# Altium schematic sheet PRYECTO.SchDoc
size B
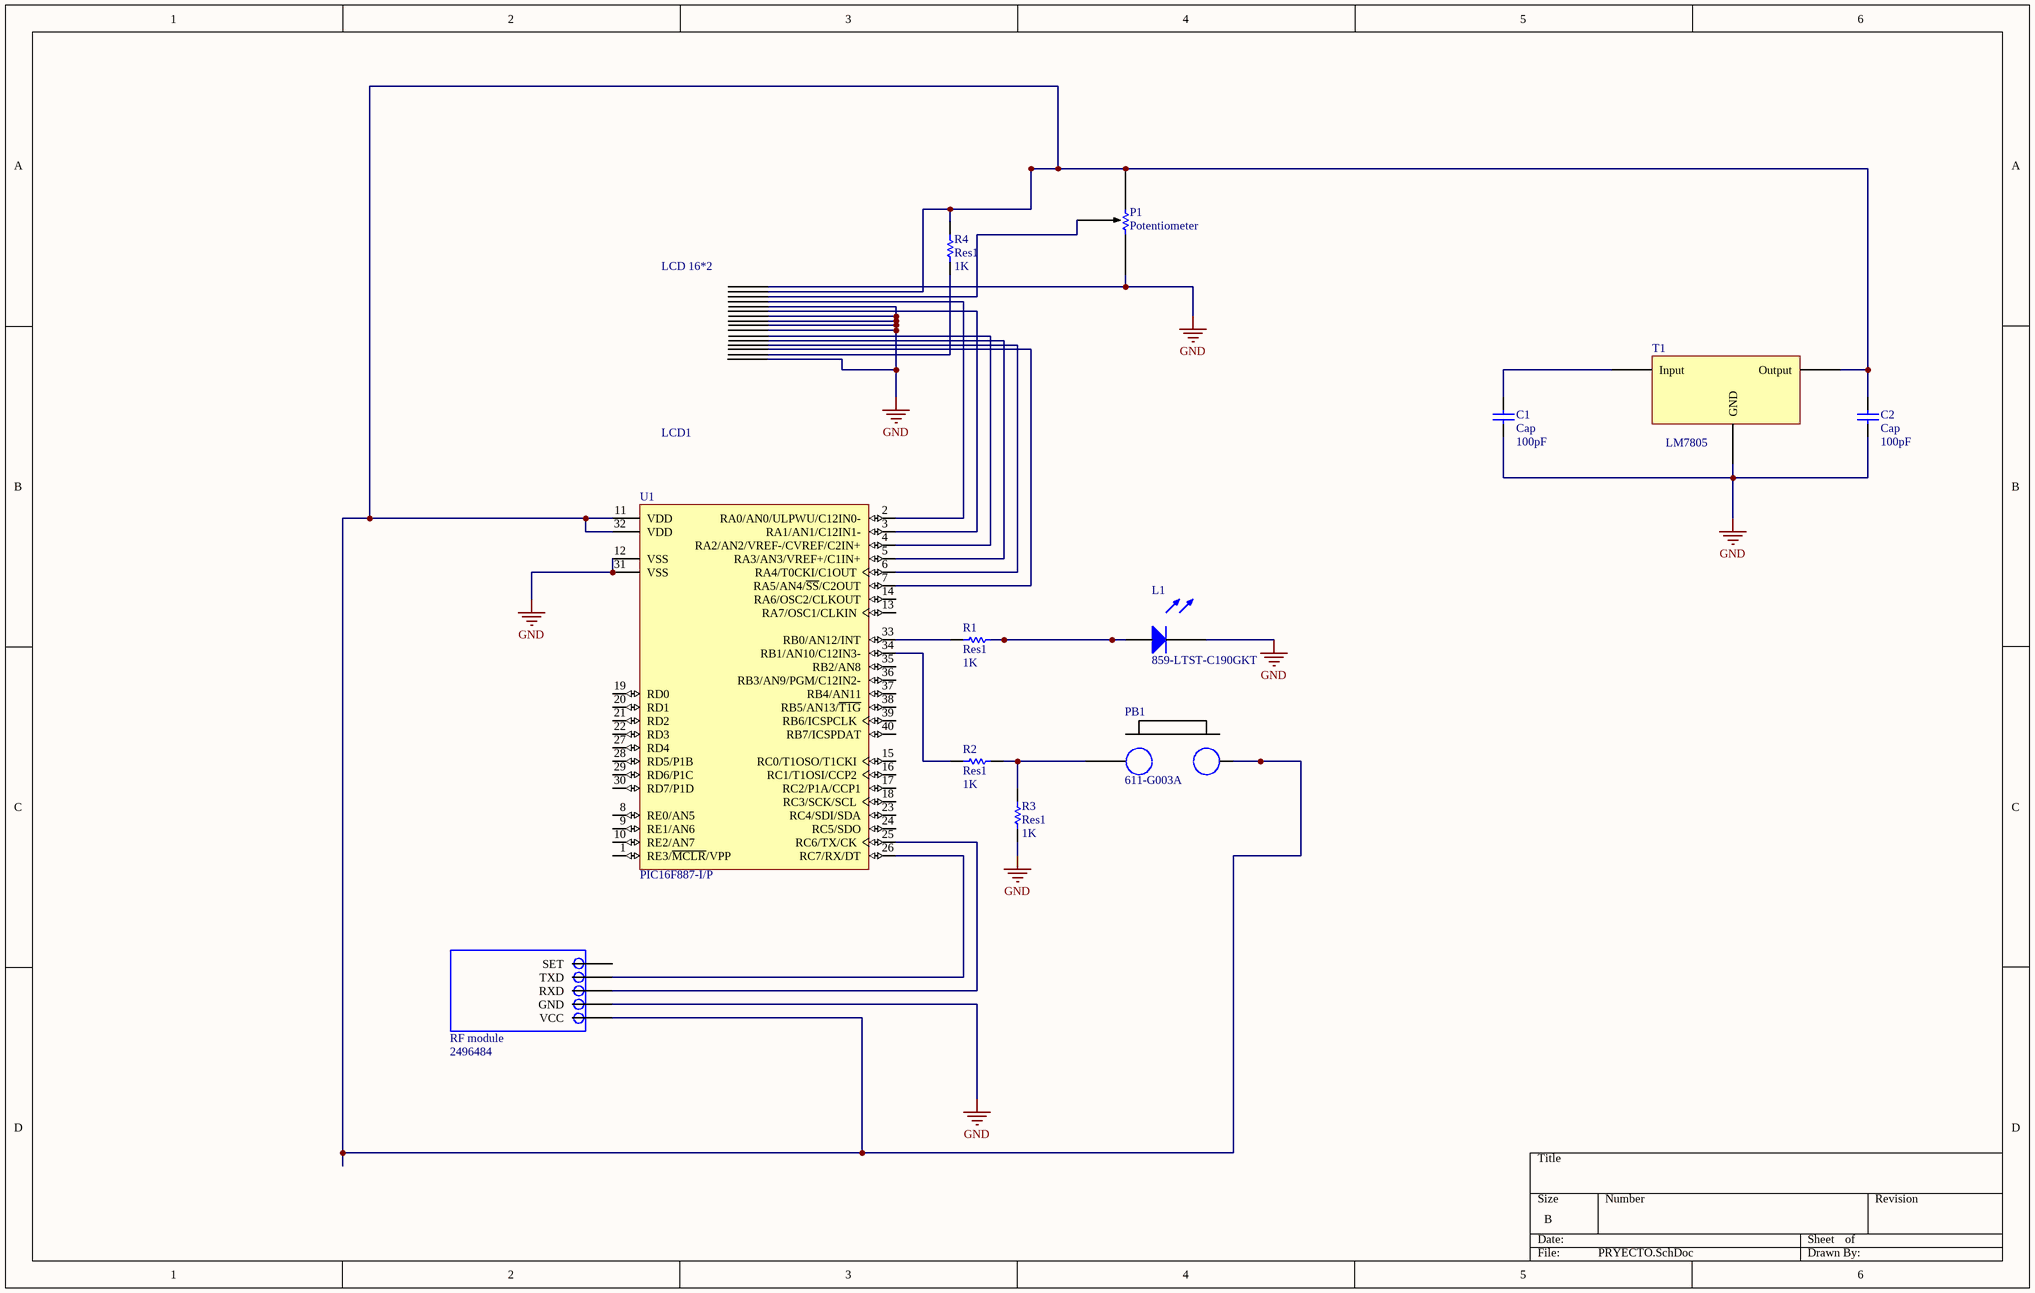
[diagram p0: PRYECTO.SchDoc]

## Parts
C1  Cap  value 100pF  [RAD-0.3]
C2  Cap  value 100pF  [RAD-0.3]
L1  Supplier Part Number 1: 859-LTST-C190GKT  [LED]  (hidden comment: LED)
LCD1  LCD 16*2  [LCD]
P1  Potentiometer  [Potentiometer]
PB1  Supplier Part Number 1: 611-G003A  [Push Button]  (hidden comment: Push Button 2-Pin)
R1  Res1  value 1K  [AXIAL-0.3]
R2  Res1  value 1K  [AXIAL-0.3]
R3  Res1  value 1K  [AXIAL-0.3]
R4  Res1  value 1K  [AXIAL-0.3]
T1  LM7805  [LM7805]
U1  PIC16F887-I/P  [PDIP600-P40]
U2  RF module  Supplier Part Number 1: 2496484  [HC-12]

## Nets
GND: C1.1 C2.1 L1.2 LCD1.D0 LCD1.D1 LCD1.D2 LCD1.D3 LCD1.K LCD1.RW LCD1.VSS P1.3 R3.1 T1.Ground(GND) U1.12(VSS) U1.31(VSS) U2.4(GND)
NetC1_2: C1.2 T1.Input
NetC2_2: C2.2 LCD1.VDD P1.1 PB1.2 R4.2 T1.Output U1.11(VDD) U1.32(VDD) U2.5(VCC)
NetL1_1: L1.1 R1.2
NetLCD1_A: LCD1.A R4.1
NetLCD1_D4: LCD1.D4 U1.4(RA2/AN2/VREF-/CVREF/C2IN+)
NetLCD1_D5: LCD1.D5 U1.5(RA3/AN3/VREF+/C1IN+)
NetLCD1_D6: LCD1.D6 U1.6(RA4/T0CKI/C1OUT)
NetLCD1_D7: LCD1.D7 U1.7(RA5/AN4/~{SS}/C2OUT)
NetLCD1_E: LCD1.E U1.3(RA1/AN1/C12IN1-)
NetLCD1_RS: LCD1.RS U1.2(RA0/AN0/ULPWU/C12IN0-)
NetLCD1_V0: LCD1.V0 P1.2
NetPB1_1: PB1.1 R2.2 R3.2
NetR1_1: R1.1 U1.33(RB0/AN12/INT)
NetR2_1: R2.1 U1.34(RB1/AN10/C12IN3-)
NetU1_25: U1.25(RC6/TX/CK) U2.3(RXD)
NetU1_26: U1.26(RC7/RX/DT) U2.2(TXD)

Not connected (* = marked no-connect by the designer): U1 1(RE3/~{MCLR}/VPP) 8(RE0/AN5) 9(RE1/AN6) 10(RE2/AN7) 13(RA7/OSC1/CLKIN) 14(RA6/OSC2/CLKOUT) 15(RC0/T1OSO/T1CKI) 16(RC1/T1OSI/CCP2) 17(RC2/P1A/CCP1) 18(RC3/SCK/SCL) 19(RD0) 20(RD1) 21(RD2) 22(RD3) 23(RC4/SDI/SDA) 24(RC5/SDO) 27(RD4) 28(RD5/P1B) 29(RD6/P1C) 30(RD7/P1D) 35(RB2/AN8) 36(RB3/AN9/PGM/C12IN2-) 37(RB4/AN11) 38(RB5/AN13/~{T1G}) 39(RB6/ICSPCLK) 40(RB7/ICSPDAT); U2 1(SET)

## Library data of the parts
C1 C2 = Cap: Capacitor Ceramico; Manufacturer: KEMET; Manufacturer Part Number: C0402C104K8PACTU; Capacitance: 100nF; Tolerance: 10%; Voltage Rating: 10V; Dielectric: X5R; Dissipation Factor: 5%; Published: 8-Jun-2000; LatestRevisionDate: 17-Jul-2002; LatestRevisionNote: Re-released for DXP Platform.; PackageReference: RAD-0.3; Publisher: Altium Limited; PackageDescription: Radial Cap, Thru-Hole; 2 Leads; 0.3 in Pin Spacing; Supplier 1: Arrow; Stock 1: 0; Mount: PCB,Surface Mount; Case/Package: 0402; Number of Pins: 2; Case Code (Metric): 1005; Case Code (Imperial): 0402; Dielectric Material: Ceramic; Contact Plating: Matte,Tin; Min Operating Temperature: -55°C; Max Operating Temperature: 85°C; Voltage Rating (DC): 10V; Package Quantity: 1; Packaging: Tape and Reel; Termination: SMD/SMT; Voltage: 10V; Length: 1mm; Height: 0.5mm; Width: 0.02inch; Depth: 0.5mm; Thickness: 0.022inch; Lead Pitch: 0.3mm; Radiation Hardening: No; REACH SVHC: No SVHC; Lead Free: Lead Free; Supplier Part Number 1: C0402C104K8PAC7867
L1 = LED: Manufacturer: Vishay Lite-On; Manufacturer Part Number: LTST-C190GKT; Colour: Green; Lens Colour: Clear,Colorless; Luminous Intensity: 6mcd; Forward Voltage: 2.1V; Viewing Angle: 130°; Lens Style: Clear,Colorless,Diffused,Rectangular; Forward Current: 30mA; Test Current: 10mA; Number of Elements: 1; Power Dissipation: 100mW; Reverse Voltage: 5V; Dominant Wavelength: 569nm; Wavelength: 565nm; Lens Transparency: Clear; Voltage: 2V; Current: 1A; Supplier 1: Mouser; Stock 1: 402291; Pricing 1: 1=0.25, 10=0.13, 50=0.13, 100=0.061, 1000=0.045, 10000=0.034 (USD); Mount: Surface Mount; Case/Package: 0603; Number of Pins: 2; Case Code (Metric): 1608; Case Code (Imperial): 0603; Min Operating Temperature: -55°C; Max Operating Temperature: 85°C; Package Quantity: 1; Packaging: Tape and Reel; Illumination Colour: Green; Number of LEDs: 1; Power Rating: 100mW; Length: 1.6mm; Height: 0.8mm; Width: 0.8mm; Depth: 0.8mm; Radiation Hardening: No; Lead Free: Lead Free
LCD1 = LCD: Manufacturer: Newhaven Display; Manufacturer Part Number: NHD-0216K3Z-FL-GBW-V3; Interface: I2C,RS-232,SPI; Operating Supply Voltage: 5V; Backlight Type: LED; Number of Characters: 32; Background Colour: Green; Supplier 1: Allied Electronics; Stock 1: 0; Min Operating Temperature: -20°C; Max Operating Temperature: 70°C; Package Quantity: 100; Supplier Part Number 1: 70518162
P1 = Potentiometer: Manufacturer: Bourns; Manufacturer Part Number: 91A1A-G28-B15L; Resistance: 10kR; Tolerance: 20%; Power Rating: 500mW; Number of Gangs: 1; Temperature Coefficient: 1000ppm/°C; Voltage Rating: 1.5kV; Max Power Dissipation: 1W; Actuator Length: 0.875inch; Actuator Diameter: 0.25inch; Hole Diameter: 9.525mm; Supplier 1: Mouser; Stock 1: 86; Pricing 1: 1=7.31, 10=7.05, 50=5.75, 100=5.22, 1000=3.53, 10000=3.53 (USD); Mount: Panel,Through Hole; Case/Package: Metal; Weight: 0.447979oz; Min Operating Temperature: -40°C; Max Operating Temperature: 125°C; Composition: Conductive Plastic; Termination: Pin; Number of Turns: 1; Packaging: Bulk; Package Quantity: 5; Taper: Linear; Voltage Rating (DC): 1.5kV; Length: 15.88mm; Width: 15.88mm; Depth: 22.86mm; REACH SVHC: No SVHC; Supplier Part Number 1: 652-91A1A-G28-B15L
PB1 = Push button: Manufacturer: ITT C&K; Manufacturer Part Number: G003A; Shape: Round; Illumination Type: Non-Illuminated; Illumination Colour: Black; Supplier 1: Mouser; Stock 1: 2542; Pricing 1: 1=0.44, 10=0.44, 50=0.425, 100=0.416, 1000=0.296, 10000=0.28 (USD); Colour: Black; Packaging: Bulk; Package Quantity: 500; Diameter: 6.2mm; Height: 9.04mm; Radiation Hardening: No; Lead Free: Lead Free
R1-R4 = Res1: Resistor; Published: 8-Jun-2000; LatestRevisionDate: 17-Jul-2002; LatestRevisionNote: Re-released for DXP Platform.; PackageReference: AXIAL-0.3; Publisher: Altium Limited; PackageDescription: Axial Device, Thru-Hole; 2 Leads; 0.3 in Pin Spacing
T1 = LM7805: Voltage Regulator; Manufacturer: ON Semiconductor / Fairchild; Manufacturer Part Number: LM7805CT; Output Voltage: 5V; Number of Outputs: 1; Max Input Voltage: 35V; Polarity: Positive; Output Type: Fixed; Output Current: 1A; Min Input Voltage: 7V; Quiescent Current: 8mA; Dropout Voltage: 2V; Accuracy: 4%; Power Supply Rejection Ratio (PSRR): 73dB; Max Output Voltage: 5.2V; Supplier 1: Newark; Stock 1: 0; Mount: Through Hole; Case/Package: TO-220-3; Number of Pins: 3; Weight: 1.214g; Min Operating Temperature: -40°C; Max Operating Temperature: 125°C; Packaging: Rail/Tube; Package Quantity: 50; Number of Regulators: 1; Output Voltage Accuracy: 4%; Max Output Current: 1A; Current Rating: 1A; Nominal Output Voltage: 5V; Min Output Voltage: 5V; Length: 10.67mm; Height: 16.3mm; Width: 4.7mm; Radiation Hardening: No; Lead Free: Lead Free; REACH SVHC: No SVHC; Supplier Part Number 1: 34C1092
U1 = PIC16F887-I/P: Flash-Based, 8-Bit CMOS Microcontroller with nanoWatt Technology, 8K (x14-Bit words) Program Memory, 624 Bytes Data Memory, 35 I/O pins, 40-Pin PDIP, Standard VDD Range, Industrial Temperature; Published: 29-Jan-2009; LatestRevisionDate: 02-Dec-2009; LatestRevisionNote: Updated datasheet to version revF, Apr-2009.; DatasheetVersion: revF, Apr-2009; PackageVersion: revBB, Aug-2009; PackageReference: PDIP600-P40; Publisher: Altium Limited; PackageDescription: 40-Lead Plastic Dual In-Line (P) - 600 mil Body [PDIP]; Supplier 1: Digi-Key; Supplier Part Number 1: PIC16F887-I/P-ND; Supplier 2: Farnell; Supplier Part Number 2: 1439541; ComponentLink1Description: Datasheet; ComponentLink1URL: http://ww1.microchip.com/downloads/en/DeviceDoc/41291F.pdf; ComponentLink2Description: Packaging Specification; ComponentLink2URL: http://www.microchip.com/stellent/groups/techpub_sg/documents/packagingspec/en012702.pdf; ComponentLink3Description: Microchip.com Home; ComponentLink3URL: http://www.microchip.com/
U2 = HC-12: HC-11 1000m; Manufacturer: Microchip; Manufacturer Part Number: MRF89XAM8A-I/RM; Max Supply Voltage: 3.6V; Min Supply Voltage: 2.1V; Operating Supply Voltage: 3.3V; Data Rate: 40Kbps; Number of Channels: 59; Nominal Supply Current: 25mA; Interface: SPI; Frequency: 870MHz; Sensitivity: -113dBm; Current - Receiving: 3mA; Logic Function: Transceiver; Propagation Delay: 25ns; Number of Transmitters: 1; Simplex/Duplex: Half Duplex; Operating Supply Current: 18mA; Mount: Surface Mount; Case/Package: Module; Number of Pins: 12; Contact Plating: Matte,Tin; Min Operating Temperature: -40°C; Max Operating Temperature: 85°C; Packaging: Tray; Package Quantity: 54; Max Frequency: 870MHz; Current - Transmitting: 25mA; Length: 27.94mm; Height: 0.075inch; Width: 0.7inch; Depth: 17.78mm; Radiation Hardening: No; Lead Free: Lead Free; REACH SVHC: No SVHC; Supplier 1: Farnell; Stock 1: 13; Pricing 1: 1=49.59, 5=48.04, 10=47.12, 25=40.3 (GBP); Weight: 0.004706oz; Number of Receivers: 1; Number of Drivers: 1; Number of Transceivers: 1